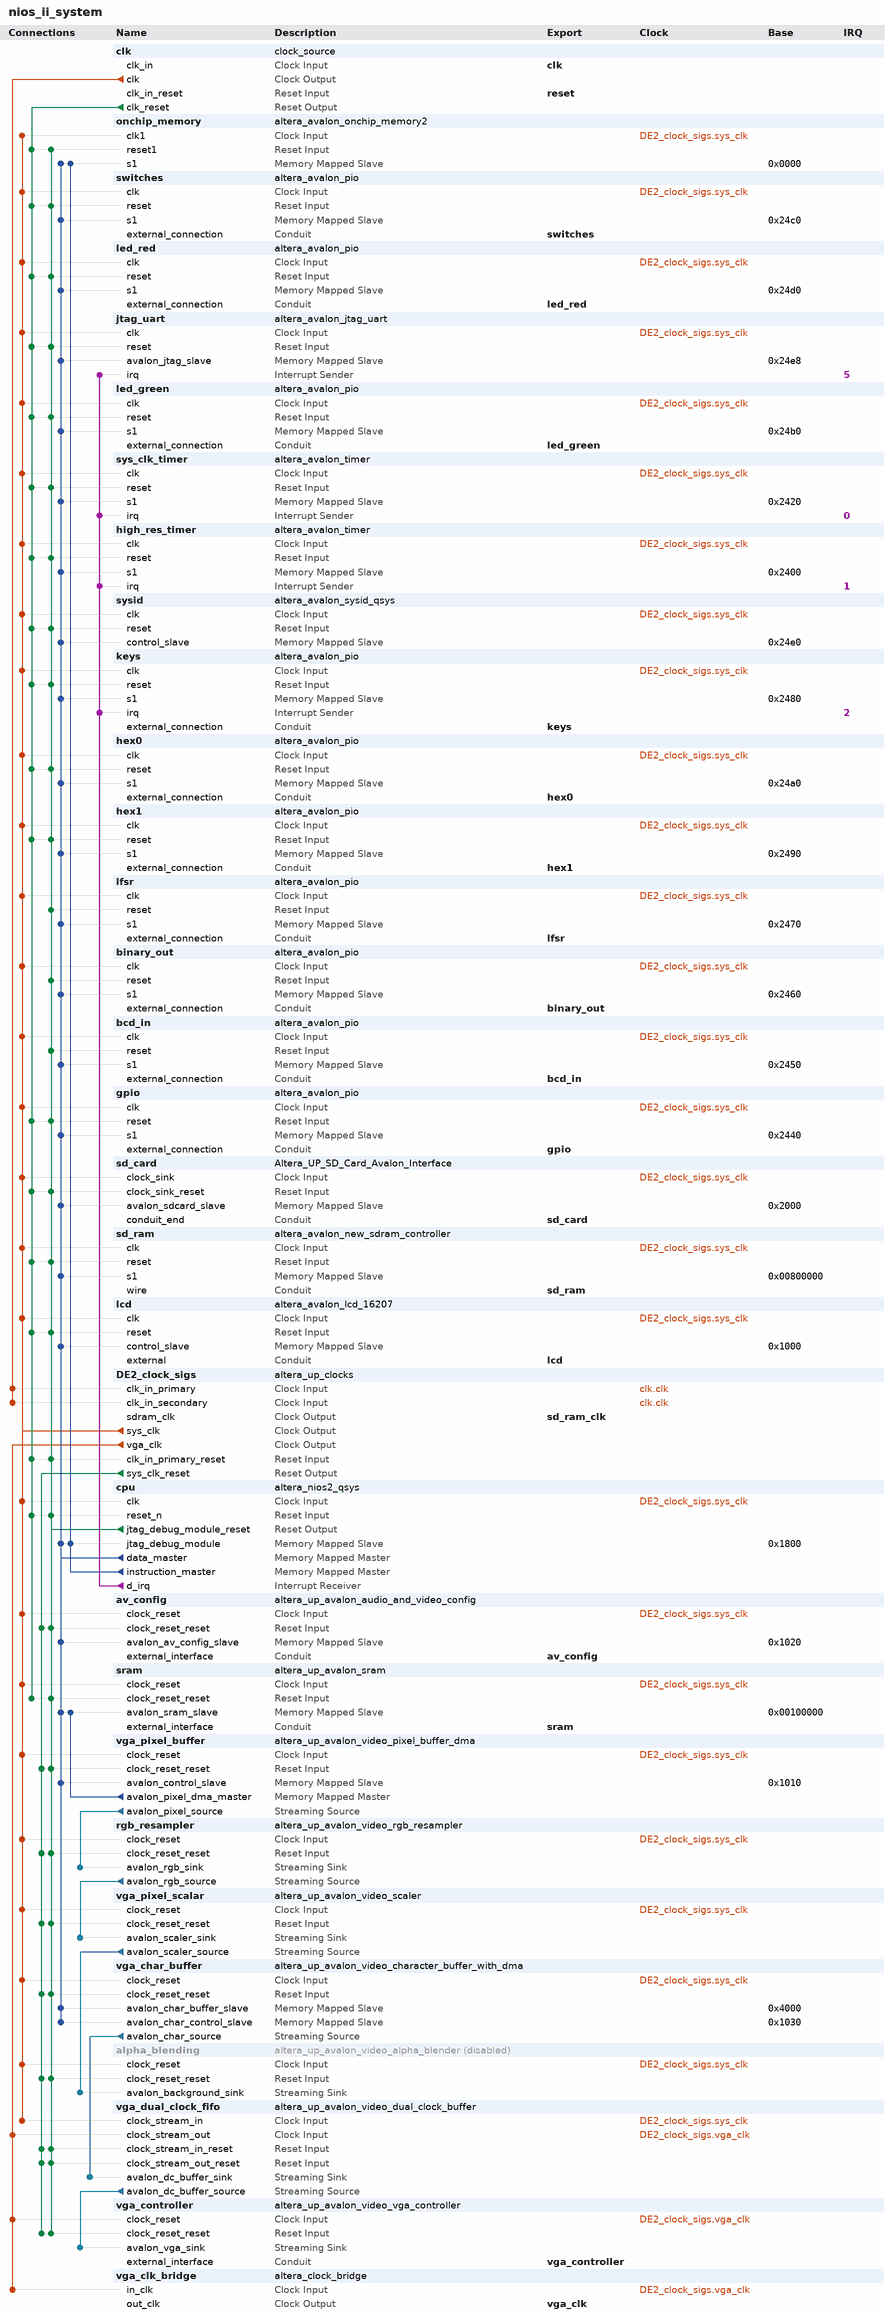
[diagram p0: system contents]
# Platform Designer (Qsys) system nios_ii_system, Cyclone II EP2C35F672C6
# Parameters at their usual value, and those the tool derives, are not listed.
package require -exact qsys 13.0.1.99.2
create_system nios_ii_system
set_project_property DEVICE_FAMILY {Cyclone II}
set_project_property DEVICE EP2C35F672C6

add_instance clk clock_source 13.0
set_instance_parameter_value clk clockFrequency 50000000

add_instance onchip_memory altera_avalon_onchip_memory2 13.0.1.99.2
set_instance_parameter_value onchip_memory dataWidth 32
set_instance_parameter_value onchip_memory dualPort false
set_instance_parameter_value onchip_memory initMemContent true
set_instance_parameter_value onchip_memory initializationFileName onchip_mem.hex
set_instance_parameter_value onchip_memory memorySize 4096

add_instance switches altera_avalon_pio 13.0.1.99.2
set_instance_parameter_value switches direction Input
set_instance_parameter_value switches width 8

add_instance led_red altera_avalon_pio 13.0.1.99.2
set_instance_parameter_value led_red direction Output
set_instance_parameter_value led_red width 8

add_instance jtag_uart altera_avalon_jtag_uart 13.0.1.99.2
set_instance_parameter_value jtag_uart simInteractiveOptions NO_INTERACTIVE_WINDOWS

add_instance led_green altera_avalon_pio 13.0.1.99.2
set_instance_parameter_value led_green direction Output
set_instance_parameter_value led_green width 8

add_instance sys_clk_timer altera_avalon_timer 13.0.1.99.2
set_instance_parameter_value sys_clk_timer period 1
set_instance_parameter_value sys_clk_timer periodUnits MSEC

add_instance high_res_timer altera_avalon_timer 13.0.1.99.2
set_instance_parameter_value high_res_timer period 1
set_instance_parameter_value high_res_timer periodUnits USEC

add_instance sysid altera_avalon_sysid_qsys 13.0
set_instance_parameter_value sysid id 0

add_instance keys altera_avalon_pio 13.0.1.99.2
set_instance_parameter_value keys captureEdge true
set_instance_parameter_value keys direction Input
set_instance_parameter_value keys edgeType FALLING
set_instance_parameter_value keys generateIRQ true
set_instance_parameter_value keys irqType EDGE
set_instance_parameter_value keys width 3

add_instance hex0 altera_avalon_pio 13.0.1.99.2
set_instance_parameter_value hex0 direction Output
set_instance_parameter_value hex0 width 28

add_instance hex1 altera_avalon_pio 13.0.1.99.2
set_instance_parameter_value hex1 direction Output
set_instance_parameter_value hex1 width 28

add_instance lfsr altera_avalon_pio 13.0.1.99.2
set_instance_parameter_value lfsr direction Input
set_instance_parameter_value lfsr width 5

add_instance binary_out altera_avalon_pio 13.0.1.99.2
set_instance_parameter_value binary_out direction Output
set_instance_parameter_value binary_out width 12

add_instance bcd_in altera_avalon_pio 13.0.1.99.2
set_instance_parameter_value bcd_in direction Input
set_instance_parameter_value bcd_in width 12

add_instance gpio altera_avalon_pio 13.0.1.99.2
set_instance_parameter_value gpio direction Bidir
set_instance_parameter_value gpio edgeType FALLING
set_instance_parameter_value gpio width 7

add_instance sd_card Altera_UP_SD_Card_Avalon_Interface 13.0

add_instance sd_ram altera_avalon_new_sdram_controller 13.0.1.99.2
set_instance_parameter_value sd_ram TAC 5.5
set_instance_parameter_value sd_ram TRCD 20.0
set_instance_parameter_value sd_ram TRP 20.0
set_instance_parameter_value sd_ram casLatency 3
set_instance_parameter_value sd_ram columnWidth 8
set_instance_parameter_value sd_ram dataWidth 16
set_instance_parameter_value sd_ram generateSimulationModel false
set_instance_parameter_value sd_ram model single_Micron_MT48LC4M32B2_7_chip
set_instance_parameter_value sd_ram numberOfBanks 4
set_instance_parameter_value sd_ram numberOfChipSelects 1
set_instance_parameter_value sd_ram powerUpDelay 100.0
set_instance_parameter_value sd_ram refreshPeriod 15.625
set_instance_parameter_value sd_ram rowWidth 12

add_instance lcd altera_avalon_lcd_16207 13.0.1.99.2

add_instance DE2_clock_sigs altera_up_clocks 13.0
set_instance_parameter_value DE2_clock_sigs board DE2
set_instance_parameter_value DE2_clock_sigs vga_clk true
set_instance_parameter_value DE2_clock_sigs audio_clk true
set_instance_parameter_value DE2_clock_sigs audio_clk_freq 12.288

add_instance cpu altera_nios2_qsys 13.0
set_instance_parameter_value cpu muldiv_divider true
set_instance_parameter_value cpu resetSlave onchip_memory.s1
set_instance_parameter_value cpu mmu_TLBMissExcSlave None
set_instance_parameter_value cpu exceptionSlave onchip_memory.s1
set_instance_parameter_value cpu breakSlave cpu.jtag_debug_module
set_instance_parameter_value cpu impl Small
set_instance_parameter_value cpu icache_size 4096
set_instance_parameter_value cpu debug_level Level3

add_instance av_config altera_up_avalon_audio_and_video_config 13.0
set_instance_parameter_value av_config board DE2
set_instance_parameter_value av_config audio_in {Microphone to ADC}
set_instance_parameter_value av_config line_in_bypass true
set_instance_parameter_value av_config bit_length 32
set_instance_parameter_value av_config sampling_rate {48 kHz}

add_instance sram altera_up_avalon_sram 13.0
set_instance_parameter_value sram board DE2
set_instance_parameter_value sram pixel_buffer false

add_instance vga_pixel_buffer altera_up_avalon_video_pixel_buffer_dma 13.0
set_instance_parameter_value vga_pixel_buffer addr_mode Consecutive
set_instance_parameter_value vga_pixel_buffer start_address 1048576
set_instance_parameter_value vga_pixel_buffer back_start_address 1048576
set_instance_parameter_value vga_pixel_buffer image_width 320
set_instance_parameter_value vga_pixel_buffer image_height 480
set_instance_parameter_value vga_pixel_buffer color_space {16-bit RGB}

add_instance rgb_resampler altera_up_avalon_video_rgb_resampler 13.0
set_instance_parameter_value rgb_resampler input_type {16-bit RGB}
set_instance_parameter_value rgb_resampler output_type {30-bit RGB}
set_instance_parameter_value rgb_resampler alpha 1023

add_instance vga_pixel_scalar altera_up_avalon_video_scaler 13.0
set_instance_parameter_value vga_pixel_scalar width_scaling 2
set_instance_parameter_value vga_pixel_scalar height_scaling 2
set_instance_parameter_value vga_pixel_scalar width_in 320
set_instance_parameter_value vga_pixel_scalar color_bits 10
set_instance_parameter_value vga_pixel_scalar color_planes 3

add_instance vga_char_buffer altera_up_avalon_video_character_buffer_with_dma 13.0
set_instance_parameter_value vga_char_buffer enable_transparency false

add_instance alpha_blending altera_up_avalon_video_alpha_blender 13.0
set_instance_property alpha_blending ENABLED false

add_instance vga_dual_clock_fifo altera_up_avalon_video_dual_clock_buffer 13.0
set_instance_parameter_value vga_dual_clock_fifo color_bits 10

add_instance vga_controller altera_up_avalon_video_vga_controller 13.0
set_instance_parameter_value vga_controller board DE2

add_instance vga_clk_bridge altera_clock_bridge 13.0
set_instance_parameter_value vga_clk_bridge DERIVED_CLOCK_RATE 25000000
set_instance_parameter_value vga_clk_bridge EXPLICIT_CLOCK_RATE 0

# connections
add_connection clk.clk DE2_clock_sigs.clk_in_primary clock
add_connection clk.clk DE2_clock_sigs.clk_in_secondary clock
add_connection DE2_clock_sigs.sys_clk alpha_blending.clock_reset clock
add_connection DE2_clock_sigs.sys_clk av_config.clock_reset clock
add_connection DE2_clock_sigs.sys_clk bcd_in.clk clock
add_connection DE2_clock_sigs.sys_clk binary_out.clk clock
add_connection DE2_clock_sigs.sys_clk cpu.clk clock
add_connection DE2_clock_sigs.sys_clk gpio.clk clock
add_connection DE2_clock_sigs.sys_clk hex0.clk clock
add_connection DE2_clock_sigs.sys_clk hex1.clk clock
add_connection DE2_clock_sigs.sys_clk high_res_timer.clk clock
add_connection DE2_clock_sigs.sys_clk jtag_uart.clk clock
add_connection DE2_clock_sigs.sys_clk keys.clk clock
add_connection DE2_clock_sigs.sys_clk lcd.clk clock
add_connection DE2_clock_sigs.sys_clk led_green.clk clock
add_connection DE2_clock_sigs.sys_clk led_red.clk clock
add_connection DE2_clock_sigs.sys_clk lfsr.clk clock
add_connection DE2_clock_sigs.sys_clk onchip_memory.clk1 clock
add_connection DE2_clock_sigs.sys_clk rgb_resampler.clock_reset clock
add_connection DE2_clock_sigs.sys_clk sd_card.clock_sink clock
add_connection DE2_clock_sigs.sys_clk sd_ram.clk clock
add_connection DE2_clock_sigs.sys_clk sram.clock_reset clock
add_connection DE2_clock_sigs.sys_clk switches.clk clock
add_connection DE2_clock_sigs.sys_clk sys_clk_timer.clk clock
add_connection DE2_clock_sigs.sys_clk sysid.clk clock
add_connection DE2_clock_sigs.sys_clk vga_char_buffer.clock_reset clock
add_connection DE2_clock_sigs.sys_clk vga_dual_clock_fifo.clock_stream_in clock
add_connection DE2_clock_sigs.sys_clk vga_pixel_buffer.clock_reset clock
add_connection DE2_clock_sigs.sys_clk vga_pixel_scalar.clock_reset clock
add_connection DE2_clock_sigs.vga_clk vga_clk_bridge.in_clk clock
add_connection DE2_clock_sigs.vga_clk vga_controller.clock_reset clock
add_connection DE2_clock_sigs.vga_clk vga_dual_clock_fifo.clock_stream_out clock
add_connection clk.clk_reset cpu.reset_n reset
add_connection clk.clk_reset DE2_clock_sigs.clk_in_primary_reset reset
add_connection clk.clk_reset gpio.reset reset
add_connection clk.clk_reset hex0.reset reset
add_connection clk.clk_reset hex1.reset reset
add_connection clk.clk_reset high_res_timer.reset reset
add_connection clk.clk_reset jtag_uart.reset reset
add_connection clk.clk_reset keys.reset reset
add_connection clk.clk_reset lcd.reset reset
add_connection clk.clk_reset led_green.reset reset
add_connection clk.clk_reset led_red.reset reset
add_connection clk.clk_reset onchip_memory.reset1 reset
add_connection clk.clk_reset sd_card.clock_sink_reset reset
add_connection clk.clk_reset sd_ram.reset reset
add_connection clk.clk_reset sram.clock_reset_reset reset
add_connection clk.clk_reset switches.reset reset
add_connection clk.clk_reset sys_clk_timer.reset reset
add_connection clk.clk_reset sysid.reset reset
add_connection cpu.jtag_debug_module_reset alpha_blending.clock_reset_reset reset
add_connection cpu.jtag_debug_module_reset av_config.clock_reset_reset reset
add_connection cpu.jtag_debug_module_reset bcd_in.reset reset
add_connection cpu.jtag_debug_module_reset binary_out.reset reset
add_connection cpu.jtag_debug_module_reset cpu.reset_n reset
add_connection cpu.jtag_debug_module_reset DE2_clock_sigs.clk_in_primary_reset reset
add_connection cpu.jtag_debug_module_reset gpio.reset reset
add_connection cpu.jtag_debug_module_reset hex0.reset reset
add_connection cpu.jtag_debug_module_reset hex1.reset reset
add_connection cpu.jtag_debug_module_reset high_res_timer.reset reset
add_connection cpu.jtag_debug_module_reset jtag_uart.reset reset
add_connection cpu.jtag_debug_module_reset keys.reset reset
add_connection cpu.jtag_debug_module_reset lcd.reset reset
add_connection cpu.jtag_debug_module_reset led_green.reset reset
add_connection cpu.jtag_debug_module_reset led_red.reset reset
add_connection cpu.jtag_debug_module_reset lfsr.reset reset
add_connection cpu.jtag_debug_module_reset onchip_memory.reset1 reset
add_connection cpu.jtag_debug_module_reset rgb_resampler.clock_reset_reset reset
add_connection cpu.jtag_debug_module_reset sd_card.clock_sink_reset reset
add_connection cpu.jtag_debug_module_reset sd_ram.reset reset
add_connection cpu.jtag_debug_module_reset sram.clock_reset_reset reset
add_connection cpu.jtag_debug_module_reset switches.reset reset
add_connection cpu.jtag_debug_module_reset sys_clk_timer.reset reset
add_connection cpu.jtag_debug_module_reset sysid.reset reset
add_connection cpu.jtag_debug_module_reset vga_char_buffer.clock_reset_reset reset
add_connection cpu.jtag_debug_module_reset vga_controller.clock_reset_reset reset
add_connection cpu.jtag_debug_module_reset vga_dual_clock_fifo.clock_stream_in_reset reset
add_connection cpu.jtag_debug_module_reset vga_dual_clock_fifo.clock_stream_out_reset reset
add_connection cpu.jtag_debug_module_reset vga_pixel_buffer.clock_reset_reset reset
add_connection cpu.jtag_debug_module_reset vga_pixel_scalar.clock_reset_reset reset
add_connection DE2_clock_sigs.sys_clk_reset alpha_blending.clock_reset_reset reset
add_connection DE2_clock_sigs.sys_clk_reset av_config.clock_reset_reset reset
add_connection DE2_clock_sigs.sys_clk_reset rgb_resampler.clock_reset_reset reset
add_connection DE2_clock_sigs.sys_clk_reset vga_char_buffer.clock_reset_reset reset
add_connection DE2_clock_sigs.sys_clk_reset vga_controller.clock_reset_reset reset
add_connection DE2_clock_sigs.sys_clk_reset vga_dual_clock_fifo.clock_stream_in_reset reset
add_connection DE2_clock_sigs.sys_clk_reset vga_dual_clock_fifo.clock_stream_out_reset reset
add_connection DE2_clock_sigs.sys_clk_reset vga_pixel_buffer.clock_reset_reset reset
add_connection DE2_clock_sigs.sys_clk_reset vga_pixel_scalar.clock_reset_reset reset
add_connection cpu.data_master av_config.avalon_av_config_slave avalon
set_connection_parameter_value cpu.data_master/av_config.avalon_av_config_slave baseAddress 0x1020
add_connection cpu.data_master bcd_in.s1 avalon
set_connection_parameter_value cpu.data_master/bcd_in.s1 baseAddress 0x2450
add_connection cpu.data_master binary_out.s1 avalon
set_connection_parameter_value cpu.data_master/binary_out.s1 baseAddress 0x2460
add_connection cpu.data_master cpu.jtag_debug_module avalon
set_connection_parameter_value cpu.data_master/cpu.jtag_debug_module baseAddress 0x1800
add_connection cpu.data_master gpio.s1 avalon
set_connection_parameter_value cpu.data_master/gpio.s1 baseAddress 0x2440
add_connection cpu.data_master hex0.s1 avalon
set_connection_parameter_value cpu.data_master/hex0.s1 baseAddress 0x24a0
add_connection cpu.data_master hex1.s1 avalon
set_connection_parameter_value cpu.data_master/hex1.s1 baseAddress 0x2490
add_connection cpu.data_master high_res_timer.s1 avalon
set_connection_parameter_value cpu.data_master/high_res_timer.s1 baseAddress 0x2400
add_connection cpu.data_master jtag_uart.avalon_jtag_slave avalon
set_connection_parameter_value cpu.data_master/jtag_uart.avalon_jtag_slave baseAddress 0x24e8
add_connection cpu.data_master keys.s1 avalon
set_connection_parameter_value cpu.data_master/keys.s1 baseAddress 0x2480
add_connection cpu.data_master lcd.control_slave avalon
set_connection_parameter_value cpu.data_master/lcd.control_slave baseAddress 0x1000
add_connection cpu.data_master led_green.s1 avalon
set_connection_parameter_value cpu.data_master/led_green.s1 baseAddress 0x24b0
add_connection cpu.data_master led_red.s1 avalon
set_connection_parameter_value cpu.data_master/led_red.s1 baseAddress 0x24d0
add_connection cpu.data_master lfsr.s1 avalon
set_connection_parameter_value cpu.data_master/lfsr.s1 baseAddress 0x2470
add_connection cpu.data_master onchip_memory.s1 avalon
set_connection_parameter_value cpu.data_master/onchip_memory.s1 baseAddress 0x0000
add_connection cpu.data_master sd_card.avalon_sdcard_slave avalon
set_connection_parameter_value cpu.data_master/sd_card.avalon_sdcard_slave baseAddress 0x2000
add_connection cpu.data_master sd_ram.s1 avalon
set_connection_parameter_value cpu.data_master/sd_ram.s1 baseAddress 0x00800000
add_connection cpu.data_master sram.avalon_sram_slave avalon
set_connection_parameter_value cpu.data_master/sram.avalon_sram_slave baseAddress 0x00100000
add_connection cpu.data_master switches.s1 avalon
set_connection_parameter_value cpu.data_master/switches.s1 baseAddress 0x24c0
add_connection cpu.data_master sys_clk_timer.s1 avalon
set_connection_parameter_value cpu.data_master/sys_clk_timer.s1 baseAddress 0x2420
add_connection cpu.data_master sysid.control_slave avalon
set_connection_parameter_value cpu.data_master/sysid.control_slave baseAddress 0x24e0
add_connection cpu.data_master vga_char_buffer.avalon_char_buffer_slave avalon
set_connection_parameter_value cpu.data_master/vga_char_buffer.avalon_char_buffer_slave baseAddress 0x4000
add_connection cpu.data_master vga_char_buffer.avalon_char_control_slave avalon
set_connection_parameter_value cpu.data_master/vga_char_buffer.avalon_char_control_slave baseAddress 0x1030
add_connection cpu.data_master vga_pixel_buffer.avalon_control_slave avalon
set_connection_parameter_value cpu.data_master/vga_pixel_buffer.avalon_control_slave baseAddress 0x1010
add_connection cpu.instruction_master cpu.jtag_debug_module avalon
set_connection_parameter_value cpu.instruction_master/cpu.jtag_debug_module baseAddress 0x1800
add_connection cpu.instruction_master onchip_memory.s1 avalon
set_connection_parameter_value cpu.instruction_master/onchip_memory.s1 baseAddress 0x0000
add_connection vga_pixel_buffer.avalon_pixel_dma_master sram.avalon_sram_slave avalon
set_connection_parameter_value vga_pixel_buffer.avalon_pixel_dma_master/sram.avalon_sram_slave baseAddress 0x00100000
add_connection rgb_resampler.avalon_rgb_source vga_pixel_scalar.avalon_scaler_sink avalon_streaming
add_connection vga_char_buffer.avalon_char_source vga_dual_clock_fifo.avalon_dc_buffer_sink avalon_streaming
add_connection vga_dual_clock_fifo.avalon_dc_buffer_source vga_controller.avalon_vga_sink avalon_streaming
add_connection vga_pixel_buffer.avalon_pixel_source rgb_resampler.avalon_rgb_sink avalon_streaming
add_connection vga_pixel_scalar.avalon_scaler_source alpha_blending.avalon_background_sink avalon_streaming
add_connection cpu.d_irq high_res_timer.irq interrupt
set_connection_parameter_value cpu.d_irq/high_res_timer.irq irqNumber 1
add_connection cpu.d_irq jtag_uart.irq interrupt
set_connection_parameter_value cpu.d_irq/jtag_uart.irq irqNumber 5
add_connection cpu.d_irq keys.irq interrupt
set_connection_parameter_value cpu.d_irq/keys.irq irqNumber 2
add_connection cpu.d_irq sys_clk_timer.irq interrupt
set_connection_parameter_value cpu.d_irq/sys_clk_timer.irq irqNumber 0

# exported interfaces
add_interface clk clock sink
set_interface_property clk EXPORT_OF clk.clk_in
add_interface reset reset sink
set_interface_property reset EXPORT_OF clk.clk_in_reset
add_interface switches conduit end
set_interface_property switches EXPORT_OF switches.external_connection
add_interface led_red conduit end
set_interface_property led_red EXPORT_OF led_red.external_connection
add_interface led_green conduit end
set_interface_property led_green EXPORT_OF led_green.external_connection
add_interface hex0 conduit end
set_interface_property hex0 EXPORT_OF hex0.external_connection
add_interface hex1 conduit end
set_interface_property hex1 EXPORT_OF hex1.external_connection
add_interface keys conduit end
set_interface_property keys EXPORT_OF keys.external_connection
add_interface sram conduit end
set_interface_property sram EXPORT_OF sram.external_interface
add_interface lfsr conduit end
set_interface_property lfsr EXPORT_OF lfsr.external_connection
add_interface binary_out conduit end
set_interface_property binary_out EXPORT_OF binary_out.external_connection
add_interface bcd_in conduit end
set_interface_property bcd_in EXPORT_OF bcd_in.external_connection
add_interface gpio conduit end
set_interface_property gpio EXPORT_OF gpio.external_connection
add_interface sd_card conduit end
set_interface_property sd_card EXPORT_OF sd_card.conduit_end
add_interface sd_ram conduit end
set_interface_property sd_ram EXPORT_OF sd_ram.wire
add_interface sd_ram_clk clock source
set_interface_property sd_ram_clk EXPORT_OF DE2_clock_sigs.sdram_clk
add_interface lcd conduit end
set_interface_property lcd EXPORT_OF lcd.external
add_interface av_config conduit end
set_interface_property av_config EXPORT_OF av_config.external_interface
add_interface vga_controller conduit end
set_interface_property vga_controller EXPORT_OF vga_controller.external_interface
add_interface vga_clk clock source
set_interface_property vga_clk EXPORT_OF vga_clk_bridge.out_clk

set_interconnect_requirement {$system} qsys_mm.clockCrossingAdapter HANDSHAKE
set_interconnect_requirement {$system} qsys_mm.maxAdditionalLatency 2

save_system nios_ii_system.qsys
